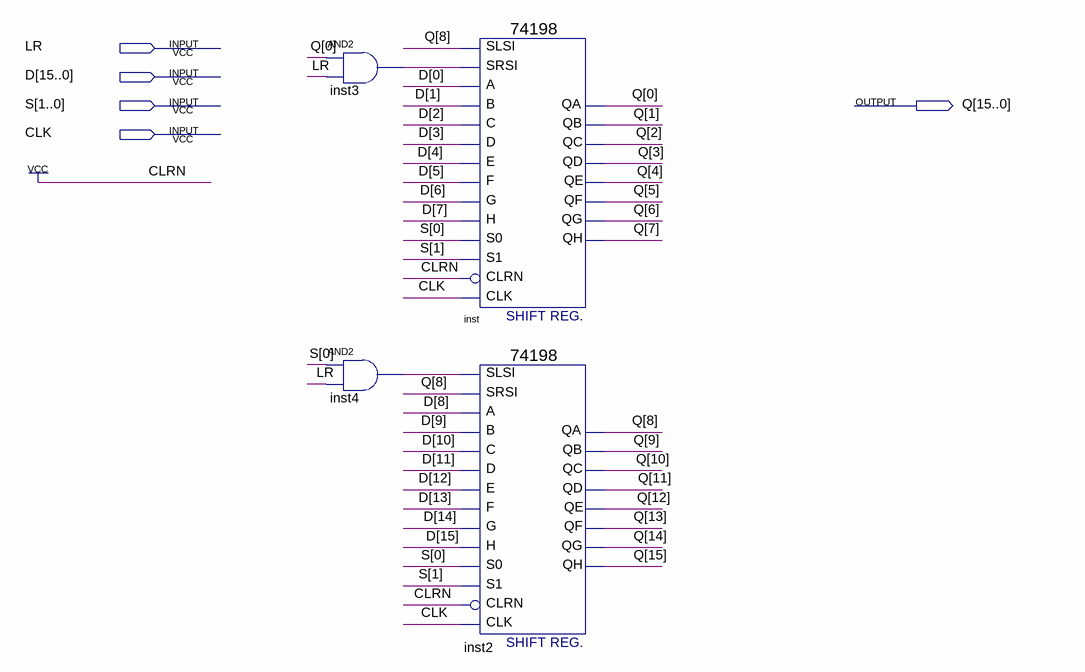
[diagram p0: schematic sheet]
// Quartus schematic 74198_16.bdf as structural Verilog: 4 symbols, 5 pins
module \74198_16  (
  input  LR,
  input  [15:0] D,
  input  [1:0] S,
  input  CLK,
  output [15:0] Q
);

  wire inst3_out, inst4_out;

  and inst3 (inst3_out, Q[0], LR);
  and inst4 (inst4_out, S[0], LR);
  \74198  inst (
    .A(D[0]), .SRSI(inst3_out), .SLSI(Q[8]), .E(D[4]), .S0(S[0]), .B(D[1]), .C(D[2]), .D(D[3]), .H(D[7]),
    .G(D[6]), .CLRN(1'b1), .CLK(CLK), .F(D[5]), .S1(S[1]), .QD(Q[3]), .QC(Q[2]), .QH(Q[7]), .QA(Q[0]),
    .QB(Q[1]), .QE(Q[4]), .QF(Q[5]), .QG(Q[6]));
  \74198  inst2 (
    .A(D[8]), .SRSI(Q[8]), .SLSI(inst4_out), .E(D[12]), .S0(S[0]), .B(D[9]), .C(D[10]), .D(D[11]), .H(D[15]),
    .G(D[14]), .CLRN(1'b1), .CLK(CLK), .F(D[13]), .S1(S[1]), .QD(Q[11]), .QC(Q[10]), .QH(Q[15]), .QA(Q[8]),
    .QB(Q[9]), .QE(Q[12]), .QF(Q[13]), .QG(Q[14]));
endmodule
